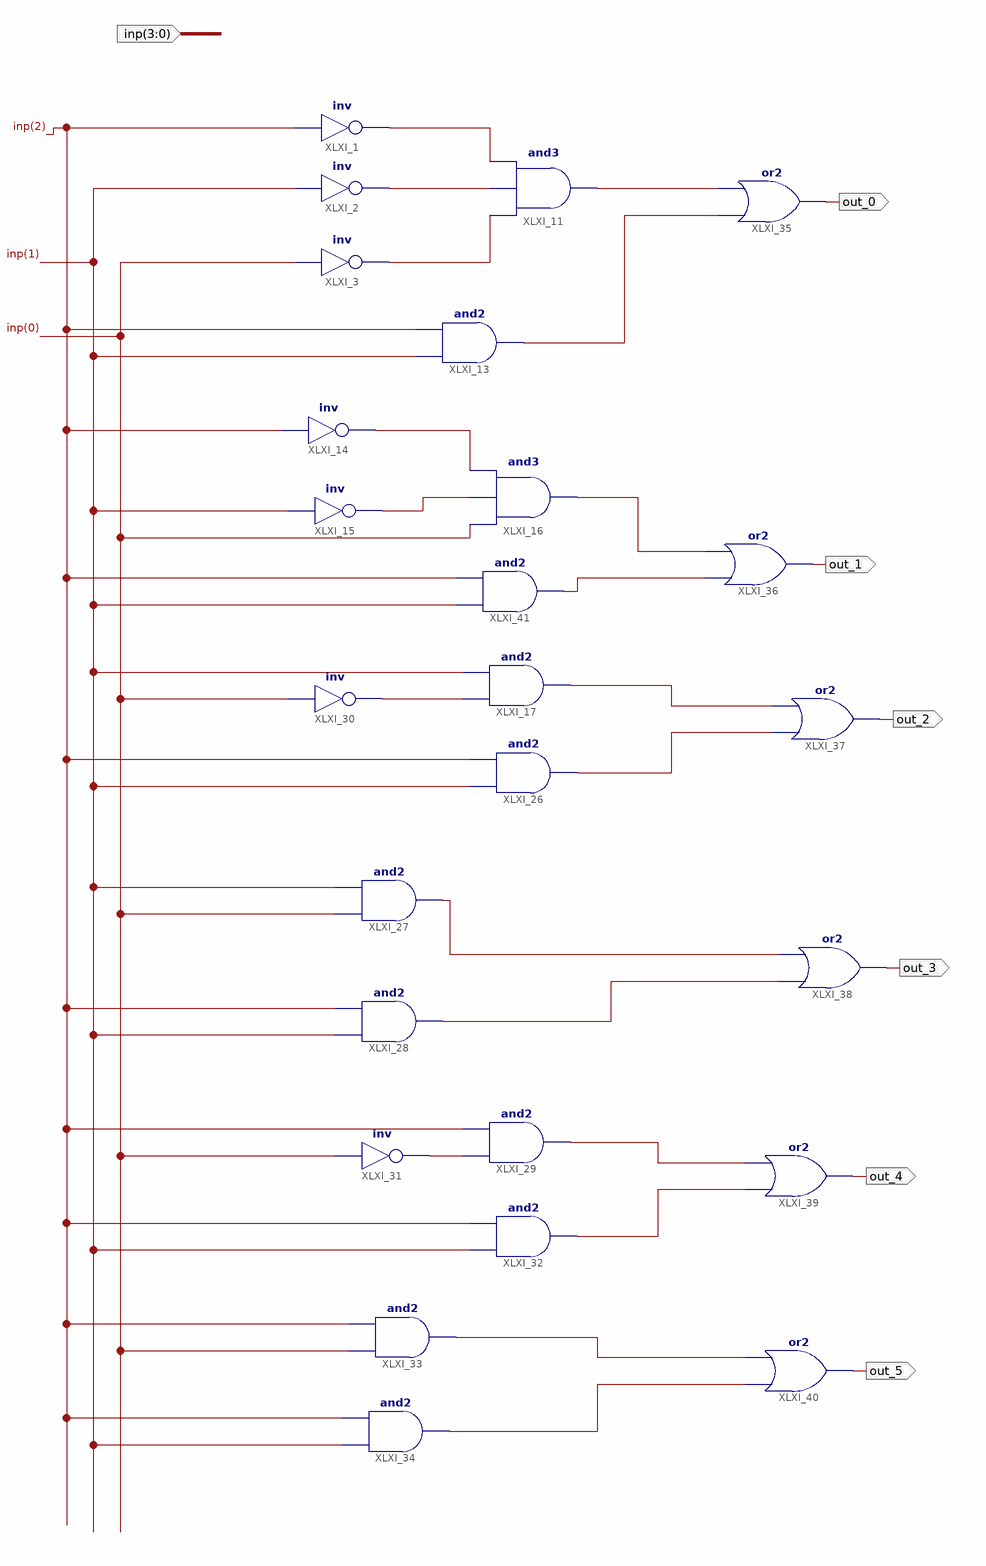
[diagram p0: schematic sheet 1]
// Xilinx ISE schematic round7seg.sch (spartan6) as structural Verilog: 25 symbols, 7 ports
module round7seg (
  input  [3:0] inp,
  output out_0,
  output out_1,
  output out_2,
  output out_3,
  output out_4,
  output out_5
);

  wire XLXN_8, XLXN_9, XLXN_10, XLXN_11, XLXN_12, XLXN_14, XLXN_15, XLXN_16, XLXN_18, XLXN_19, XLXN_20,
       XLXN_21, XLXN_23, XLXN_27, XLXN_28, XLXN_29, XLXN_30, XLXN_31, XLXN_32;

  not XLXI_1 (XLXN_8, inp[2]);
  not XLXI_2 (XLXN_9, inp[1]);
  not XLXI_3 (XLXN_10, inp[0]);
  and XLXI_11 (XLXN_11, XLXN_10, XLXN_9, XLXN_8);
  and XLXI_13 (XLXN_12, inp[1], inp[2]);
  not XLXI_14 (XLXN_15, inp[2]);
  not XLXI_15 (XLXN_14, inp[1]);
  and XLXI_16 (XLXN_16, inp[0], XLXN_14, XLXN_15);
  and XLXI_17 (XLXN_20, XLXN_19, inp[1]);
  and XLXI_26 (XLXN_21, inp[1], inp[2]);
  and XLXI_27 (XLXN_23, inp[0], inp[1]);
  and XLXI_28 (XLXN_27, inp[1], inp[2]);
  and XLXI_29 (XLXN_29, XLXN_28, inp[2]);
  not XLXI_30 (XLXN_19, inp[0]);
  not XLXI_31 (XLXN_28, inp[0]);
  and XLXI_32 (XLXN_30, inp[1], inp[2]);
  and XLXI_33 (XLXN_32, inp[0], inp[2]);
  and XLXI_34 (XLXN_31, inp[1], inp[2]);
  or XLXI_35 (out_0, XLXN_12, XLXN_11);
  or XLXI_36 (out_1, XLXN_18, XLXN_16);
  or XLXI_37 (out_2, XLXN_21, XLXN_20);
  or XLXI_38 (out_3, XLXN_27, XLXN_23);
  or XLXI_39 (out_4, XLXN_30, XLXN_29);
  or XLXI_40 (out_5, XLXN_31, XLXN_32);
  and XLXI_41 (XLXN_18, inp[1], inp[2]);
endmodule
